# EasyEDA Pro project OctoSlime_Splitter.eprj

# Schematic Schematic1
Create Date: 2022-10-06; Page Name: P1; Project Name: OctoSlime_Splitter; Schematic Name: Schematic1; Update Date: 2022-10-06
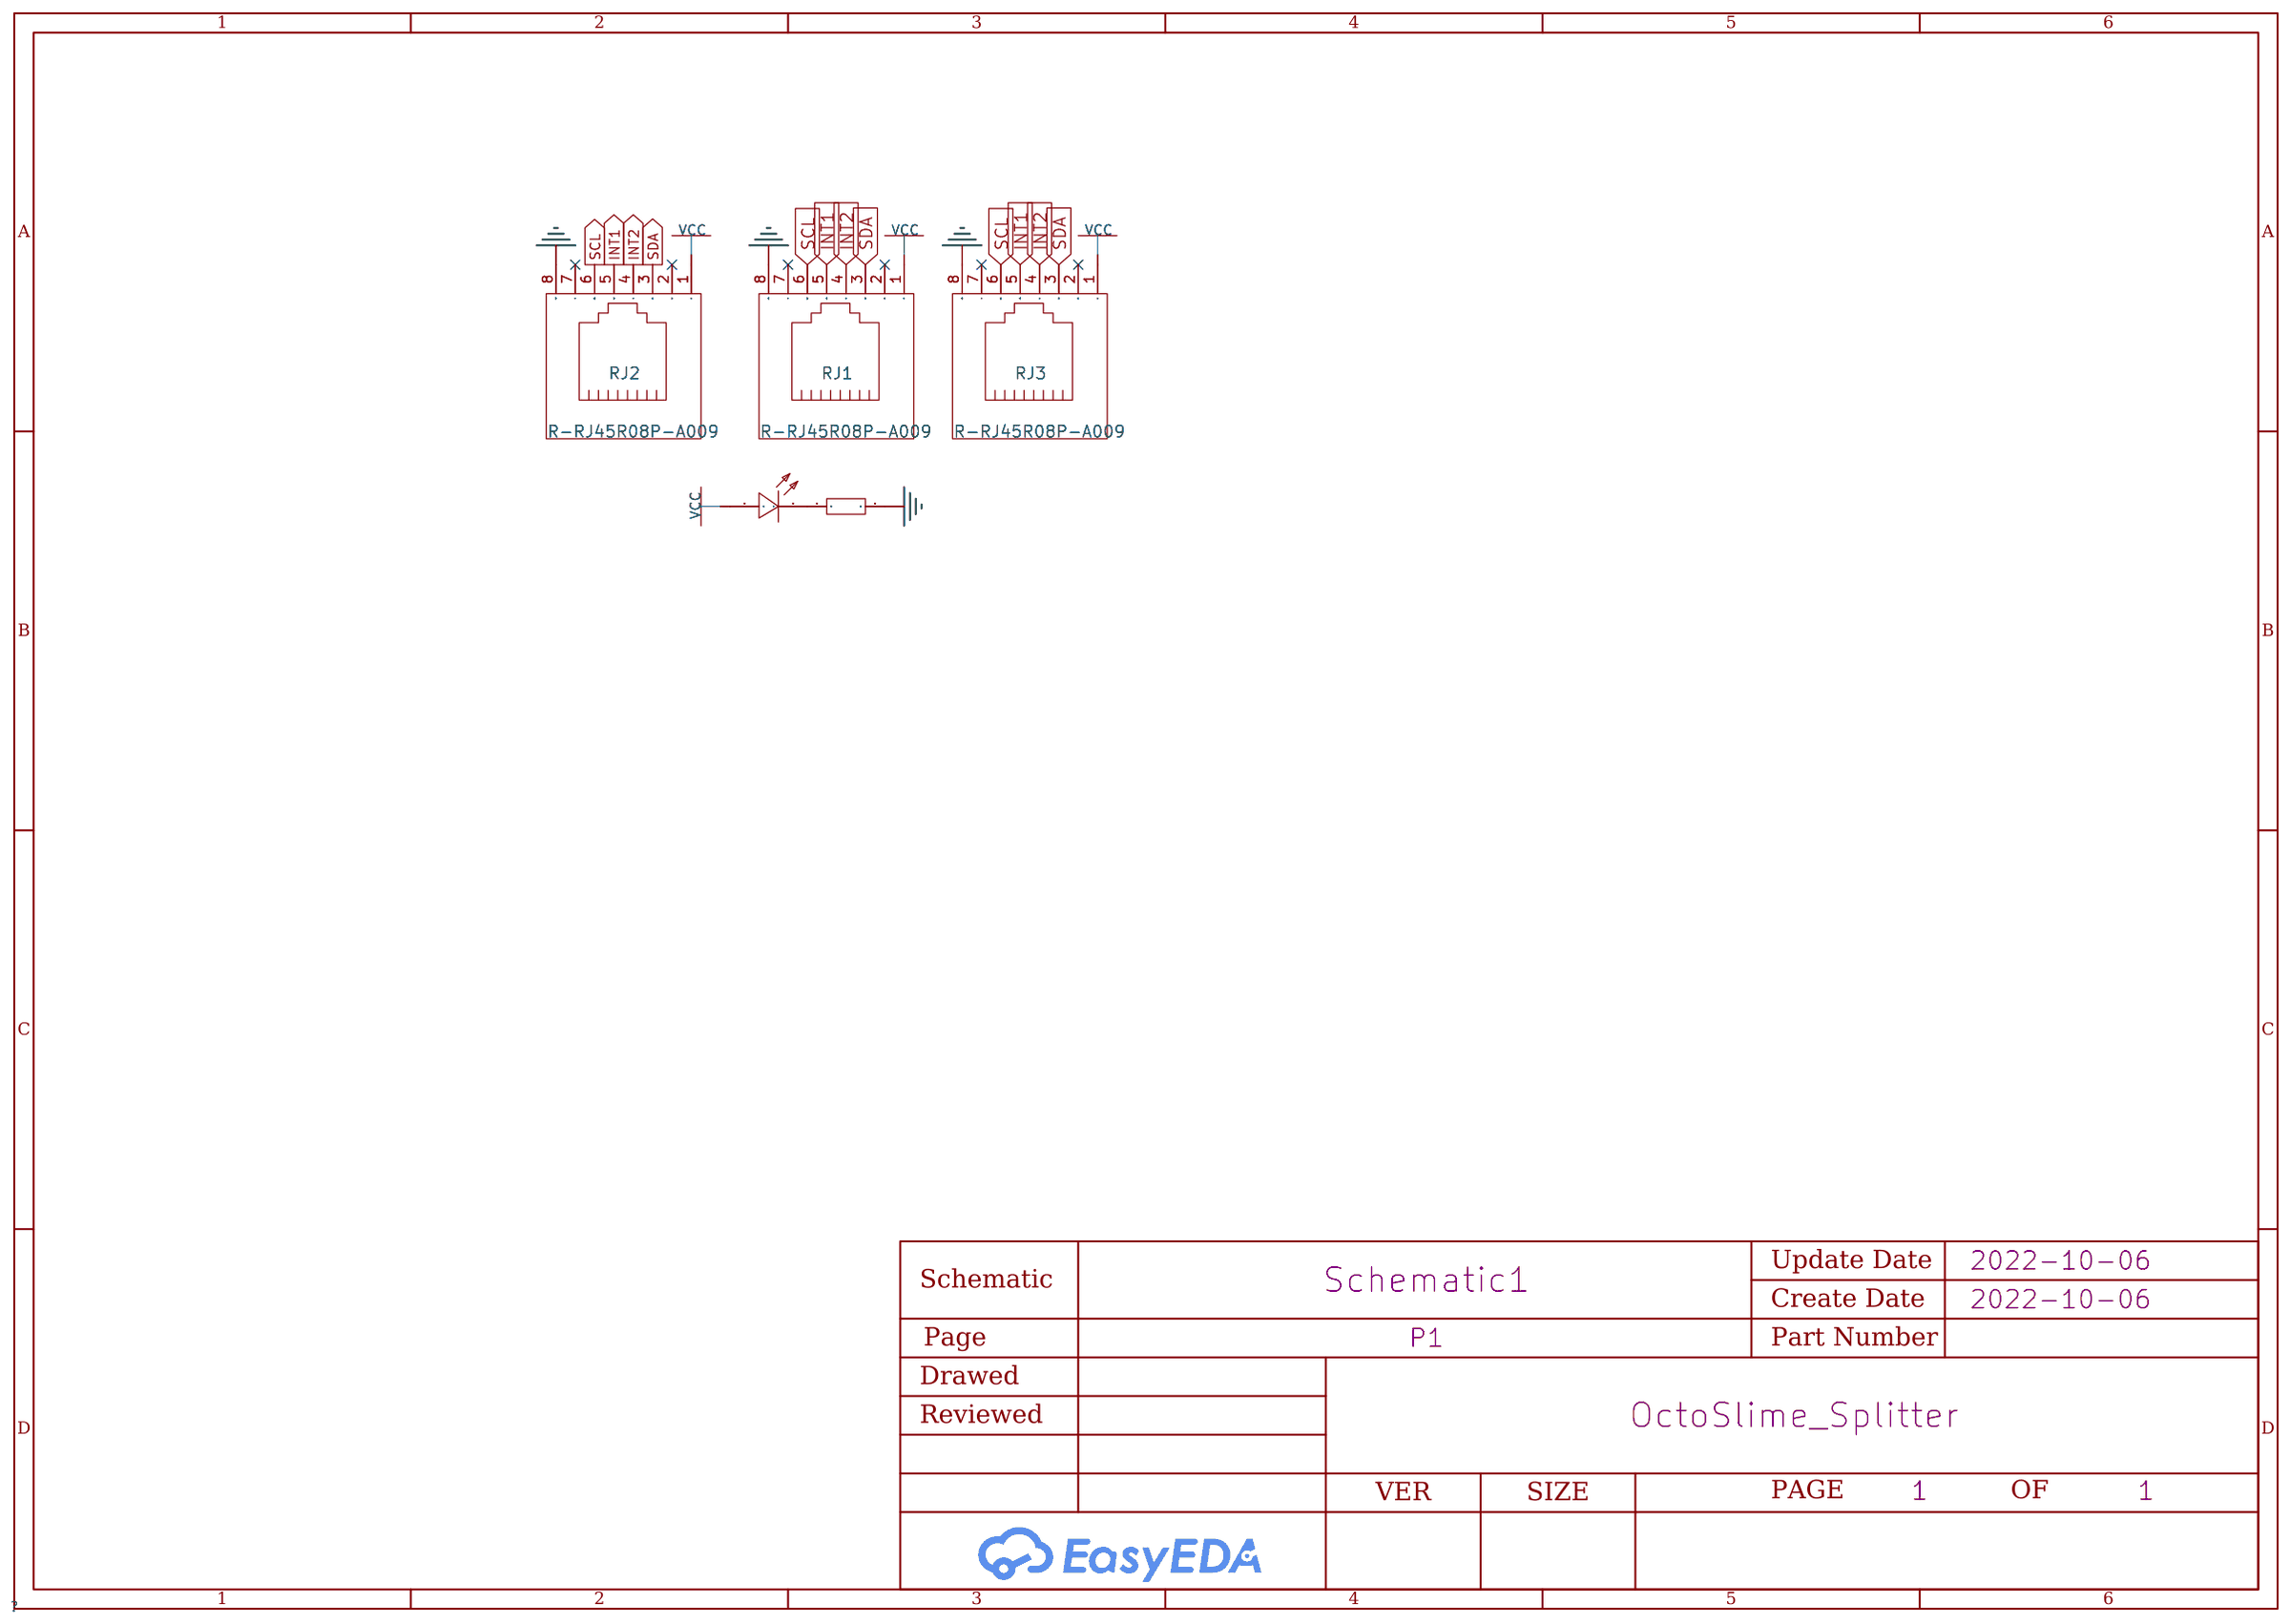
[diagram p0: schematic sheet]

## Parts
LED1  -  [LED0603-R-RD]
R3  330Ω  [R0603]
RJ1  R-RJ45R08P-A009  [RJ45-TH_R-RJ45R08P-A009]
RJ2  R-RJ45R08P-A009  [RJ45-TH_R-RJ45R08P-A009]
RJ3  R-RJ45R08P-A009  [RJ45-TH_R-RJ45R08P-A009]

## Library data of the parts
LED1 = KT-0603R: 发光颜色:红灯;二极管配置:-;透镜颜色:-;主波长:-;峰值波长:-;色温:-;光通量(25时):-;测试电流:-;正向电压(VF):-;发光强度:-;功率:-;发光角度:-;安装方式:-;工作温度:-40~+85;; LCSC Part Name: 红灯 0603 (90~100mcd); Supplier Part: C2286; Manufacturer: KENTO; Supplier Footprint: 0603; JLCPCB Part Class: Basic Part; Datasheet: https://atta.szlcsc.com/upload/public/pdf/source/20160616/1466072038404.pdf; Supplier: LCSC; Emitted Color: 红灯; Operating Temperature: -40~+85
R3 = 0603WAF3300T5E: 电阻类型:厚膜电阻;阻值:330Ω;精度:±1%;功率:1/10W;温度系数:±100ppm/;最大工作电压:75V;工作温度范围:-55~+155;; LCSC Part Name: 330Ω ±1%; Supplier Part: C23138; Manufacturer: UNI-ROYAL(厚声); Supplier Footprint: 0603; JLCPCB Part Class: Basic Part; Datasheet: https://atta.szlcsc.com/upload/public/pdf/source/20200306/C422600_1E6D84923E4A46A82E41ADD87F860B5C.pdf; Supplier: LCSC; Type: 厚膜电阻; Tolerance: ±1%; Power(Watts): 1/10W; Temperature Coefficient: ±100ppm/; Overload Voltage (Max): 75V; Operating Temperature Range: -55~+155
RJ1-RJ3 = R-RJ45R08P-A009: link: https://atta.szlcsc.com/upload/public/pdf/source/20211021/D54662BD8381AD1D1DF920996089EE18.pdf; Supplier: LCSC; Supplier Part: C2902700; Manufacturer: Ckmtw(灿科盟); JLCPCB Part Class: Extended Part

## Nets
GND: R3.2 RJ1.8 RJ2.8 RJ3.8
VCC: LED1.1(A) RJ1.1 RJ2.1 RJ3.1
INT1: RJ1.5 RJ2.5 RJ3.5
INT2: RJ1.4 RJ2.4 RJ3.4
SCL: RJ1.6 RJ2.6 RJ3.6
SDA: RJ1.3 RJ2.3 RJ3.3
$1N1174: LED1.2(K) R3.1

Not connected (* = marked no-connect by the designer): RJ1 2* 7*; RJ2 2* 7*; RJ3 2* 7*

# Board PCB1
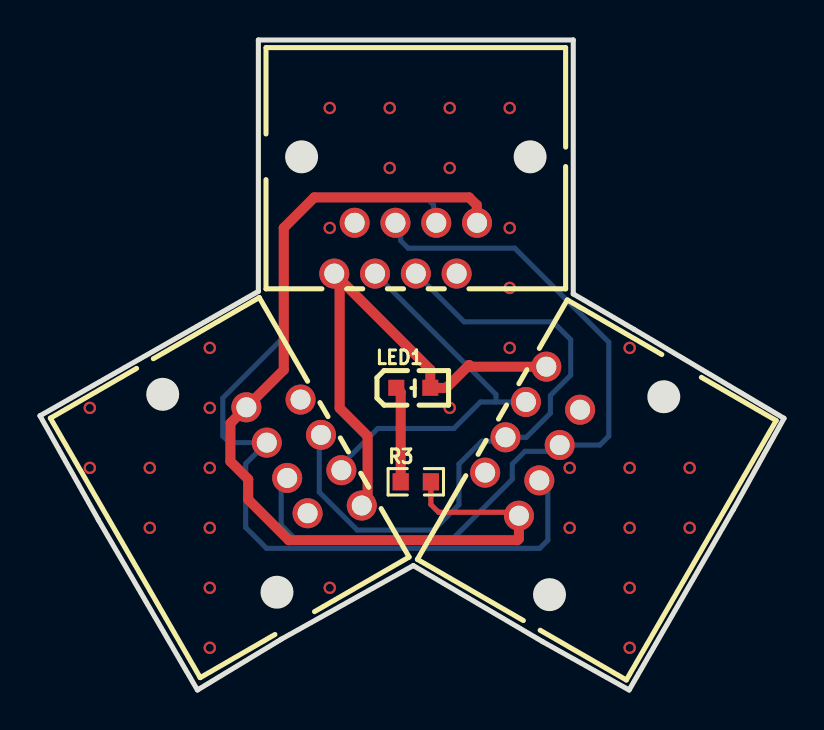
[diagram p1: board, top side]
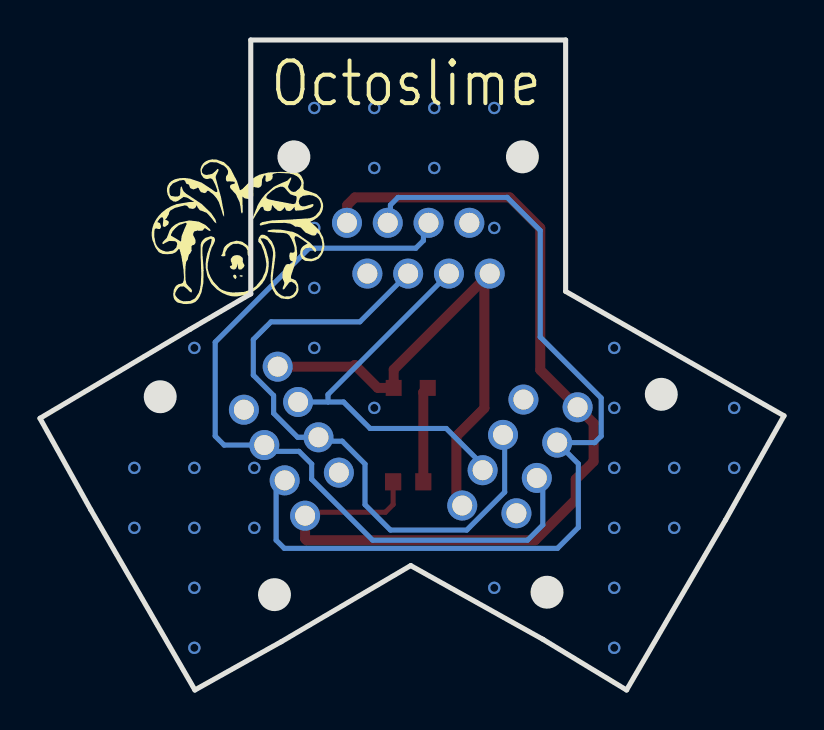
[diagram p2: board, bottom side, seen from below]

Outline 37.21 x 32.51 mm; copper layers: Top Layer, Bottom Layer. Coordinates in mm from the lower left corner of the outline.
Outline path: 0,13.72 10.92,19.94 10.92,32.51 26.67,32.51 26.67,19.81 29.72,18.03 37.21,13.59 34.67,9.02 29.46,0 25.15,2.41 18.67,6.22 12.07,2.54 7.87,0 2.92,8.51 0,13.72
Stack: Top Layer 0.035mm / Dielectric1 1.51mm FR4 er 4.5 / Bottom Layer 0.035mm

## Design rules (mm)
spacing safeClearance (default): track to track 0.152, other pairs 0.152 to 0.3
track width trackWidth (default): min 0.127, default 0.254, max 2.54
differential pair differentialPair (default): width min 0.127, default 0.254, max 2.54; gap min 0.152, default 0.152
via viaSize (default): diameter min 0.5, default 0.61, max 10; hole min 0.3, default 0.305, max 6

## Placement (name value [footprint] x y rotation side)
LED1  -  [LED0603-R-RD]  18.67 15.11 0 top
R3  330Ω  [R0603]  18.8 10.41 0 top
RJ1  R-RJ45R08P-A009  [RJ45-TH_R-RJ45R08P-A009]  24.64 12.45 60 top
RJ2  R-RJ45R08P-A009  [RJ45-TH_R-RJ45R08P-A009]  13.21 11.68 300 top
RJ3  R-RJ45R08P-A009  [RJ45-TH_R-RJ45R08P-A009]  18.29 22.1 180 top

## Footprints (pads in the part's own frame, mm; a bottom-side part is the same pattern mirrored in y, then rotated)
LED0603-R-RD
  rect 0.8x0.8 smd: 1(0.851,0) 2(-0.851,0)
R0603
  rect 0.807x0.864 smd: 1(-0.754,0) 2(0.754,0)
RJ45-TH_R-RJ45R08P-A009
  round 1.5 hole 1: 1(3.57,1.27) 2(2.55,-1.27) 3(1.53,1.27) 4(0.51,-1.27) 5(-0.51,1.27) 6(-1.53,-1.27) 7(-2.55,1.27) 8(-3.57,-1.27)

## Nets
As in the schematic.

Pads without a net: RJ1 2 7; RJ2 2 7; RJ3 2 7

## Via types
v1: diameter 0.62, hole 0.4, Top Layer to Bottom Layer, 31 vias

## Routing (per net, layer and track width the routed paths; a pad name or vN(x,y) marks a point on that pad's centre or on a via; arc(x,y) is an arc through that point)
GND: length 47.7
  Top Layer w0.254: RJ1.8 23.78,8.89 19.94,8.89 19.55,9.28 R3.2
  Top Layer w0.5: RJ1.8 23.95,7.57 23.88,7.49 12.45,7.49 10.41,9.53 10.41,10.54 9.53,11.43 9.53,13.34 RJ2.8 12.19,16.01 12.19,23.11 13.72,24.64 21.46,24.64 21.84,24.26 21.84,23.38 21.86,23.37
  vias: v1(2.49,14.11) v1(2.49,11.11) v1(5.49,11.11) v1(5.49,8.11) v1(8.49,17.11) v1(8.49,14.11) v1(8.49,11.11) v1(8.49,8.11) v1(8.49,5.11) v1(8.49,2.11) v1(14.49,29.11) v1(14.49,23.11) v1(14.49,5.11) v1(17.49,29.11) v1(17.49,26.11) v1(20.49,29.11) v1(20.49,26.11) v1(20.49,14.11) v1(23.49,29.11) v1(23.49,23.11) v1(23.49,20.11) v1(23.49,17.11) v1(26.49,11.11) v1(26.49,8.11) v1(29.49,17.11) v1(29.49,11.11) v1(29.49,8.11) v1(29.49,5.11) v1(29.49,2.11) v1(32.49,11.11) v1(32.49,8.11)
VCC: length 26
  Top Layer w0.5: 14.99,20.56 14.99,14.1 16.38,12.7 16.38,9.52 RJ2.1 ; 14.99,20.56 19.52,16.03 LED1.1 20.32,15.11 21.46,16.26 21.55,16.17 RJ1.1 ; 14.99,20.56 RJ3.1
INT1: length 32.1
  Bottom Layer w0.254: RJ2.5 13.97,12.68 13.97,9.89 15.86,8 19.69,8 20.95,9.27 20.95,11.3 22.1,12.45 23.09,12.45 RJ1.5 24.32,12.64 25.53,13.84 25.53,14.73 26.54,15.75 26.54,17.53 25.65,18.42 21.21,18.42 18.8,20.83
INT2: length 40
  Bottom Layer w0.254: RJ3.4 18.03,23.11 18.03,22.48 18.42,22.1 23.75,22.1 28.45,17.4 28.45,12.7 28,12.25 RJ1.4 25.68,11.94 24.26,11.94 23.62,11.3 23.62,10.54 20.57,7.49 12.83,7.49 12.07,8.25 12.07,10.31 RJ2.4
SCL: length 46.7
  Bottom Layer w0.254: RJ3.6 19.69,23.5 19.69,24.26 19.3,24.64 13.84,24.64 12.19,22.99 12.19,17.65 9.14,14.61 9.14,12.7 9.47,12.37 RJ2.6 10.29,11.32 10.29,8.13 11.33,7.09 24.99,7.09 25.4,7.49 25.4,10.06 RJ1.6
SDA: length 19.7
  Bottom Layer w0.254: 22.8,14.41 22.8,14.78 RJ3.3 ; 22.8,14.41 22.03,14.41 20.7,13.08 16.89,13.08 15.07,11.26 RJ2.3 ; 22.8,14.41 RJ1.3
$1N1174: length 4.8
  Top Layer w0.5: LED1.2 18.04,14.89 R3.1

## Copper pours and planes (outline as drawn; the poured copper is in the pictures)
GND on Top Layer: -0.51,33.02 37.97,33.02 37.97,-0.89 -0.51,-0.89
GND on Bottom Layer: -2.16,34.16 39.37,34.16 39.37,-2.41 -2.16,-2.41

## Text on the board
Bottom Silkscreen Layer: Octoslime
